# Altium schematic sheet SENSORS.SchDoc
size A4
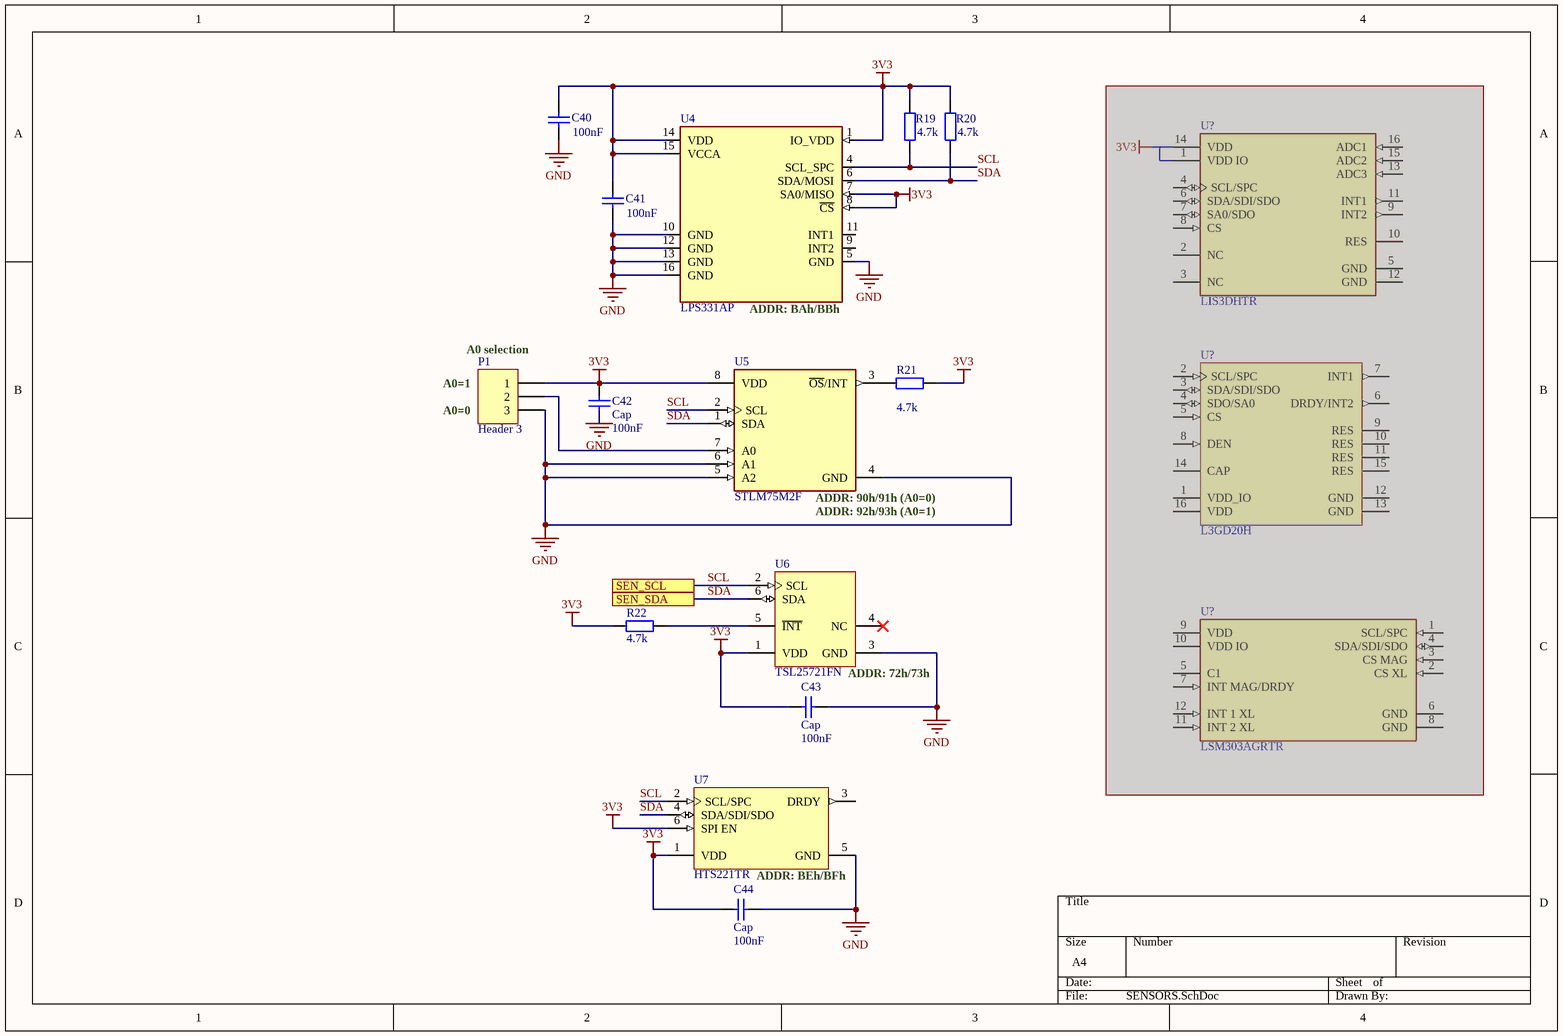
[diagram p0: SENSORS.SchDoc]

## Parts
(Parts that share a designator on the sheet are numbered #1, #2 ... from top to bottom, then left to right.)
C40  value 100nF  [0603_CAP_NPOL]  (hidden comment: Cap)
C41  value 100nF  [0603_CAP_NPOL]  (hidden comment: Cap)
C42  Cap  value 100nF  [0603_CAP_NPOL]
C43  Cap  value 100nF  [0603_CAP_NPOL]
C44  Cap  value 100nF  [0603_CAP_NPOL]
P1  Header 3  [GP_3x1_2mm]
R19  value 4.7k  [0402_RES]  (hidden comment: hy)
R20  value 4.7k  [0402_RES]  (hidden comment: hy)
R21  value 4.7k  [0402_RES]  (hidden comment: Res2)
R22  value 4.7k  [0402_RES]  (hidden comment: Res2)
U4  LPS331AP  [HCLGA-16/3MM]
U5  STLM75M2F  [FP-SO8-SO-A-MFG]
U6  TSL25721FN  [AMS-FN-6-2000X2000DE_V]
U7  HTS221TR  [STM-HTS221-HLGA-6]
U?#1  LIS3DHTR  [FP-LGA-16-7983231-MFG]  (masked out: inside a compile mask, not in the netlist)
U?#2  L3GD20H  [STM-LGA-16]  (masked out: inside a compile mask, not in the netlist)
U?#3  LSM303AGRTR  [FP-LGA-12-8487206-MFG]  (masked out: inside a compile mask, not in the netlist)

## Ports
SEN_SCL, SEN_SDA

## Nets
3V3: C40.2 C41.2 C42.2 C43.1 C44.1 P1.1 R19.2 R20.2 R21.2 R22.1 U4.1(IO_VDD) U4.7(SA0/MISO) U4.8(~{CS}) U4.14(VDD) U4.15(VCCA) U5.8(VDD) U6.1(VDD) U7.1(VDD) U7.6(SPI_EN)
GND: C40.1 C41.1 C42.1 C43.2 C44.2 P1.3 U4.5(GND) U4.10(GND) U4.12(GND) U4.13(GND) U4.16(GND) U5.4(GND) U5.5(A2) U5.6(A1) U6.3(GND) U7.5(GND)
SCL: R19.1 U4.4(SCL_SPC) U5.2(SCL) U6.2(SCL) U7.2(SCL/SPC) ; port SEN_SCL
SDA: R20.1 U4.6(SDA/MOSI) U5.1(SDA) U6.6(SDA) U7.4(SDA/SDI/SDO) ; port SEN_SDA
NetP1_2: P1.2 U5.7(A0)
NetR21_1: R21.1 U5.3(~{OS}/INT)
NetR22_2: R22.2 U6.5(~{INT})

Not connected (* = marked no-connect by the designer): U4 9(INT2) 11(INT1); U6 4(NC)*; U7 3(DRDY)

## Notes on the sheet
- (near U4) ADDR: BAh/BBh
- (near P1) A0=1
- (near P1) A0 selection
- (near P1) A0=0
- (near U5) ADDR: 90h/91h (A0=0)
- (near U5) ADDR: 92h/93h (A0=1)
- (near U6) ADDR: 72h/73h
- (near U7) ADDR: BEh/BFh

## Library data of the parts
C40-C44 = Cap: Capacitor; Published: 8-Jun-2000; LatestRevisionDate: 17-Jul-2002; LatestRevisionNote: Re-released for DXP Platform.; PackageReference: RAD-0.3; Publisher: Altium Limited; PackageDescription: Radial Cap, Thru-Hole; 2 Leads; 0.3 in Pin Spacing
P1 = Header 3: Header, 3-Pin; LatestRevisionDate: 17-Jul-2002; LatestRevisionNote: Re-released for DXP Platform.; Publisher: Altium Limited
R19 R20 R22 = Res2: Resistor; Published: 8-Jun-2000; LatestRevisionDate: 17-Jul-2002; LatestRevisionNote: Re-released for DXP Platform.; PackageReference: AXIAL-0.4; Publisher: Altium Limited; PackageDescription: Axial Device, Thru-Hole; 2 Leads; 0.4 in Pin Spacing
U4 = LPS331AP: IC PRESSURE SENSOR PIEZO 16HCLGA; Package: None; Price: None; Value: *; MP: LPS331AP; Availability: Unavailable
U5 = CMP-12184-000001-1: SENSOR DIGITAL -55C-125C 8SO; Manufacturer: STMicroelectronics; Max Supply Voltage: 5.5V; Standoff Height: 0.1mm; Operating Supply Current: 70-125uA; Resolution: 9bits; Interface: I2C,SMBus; Min Supply Voltage: 2.7V; Output Current: 10mA; Manufacturer Part Number: STLM75M2F; Device Class L1: Sensors; RoHS: TRUE; Package: SO8-SO-A; Height: 1.75mm; ComponentLink2URL: https://www.st.com/resource/en/datasheet/stlm75.pdf; Automotive: No; Mouser Description: STLM75 Series 5.5 V 10 mA Digital Temperature Sensor and Thermal Watchdog; Ambient Temperature Range Low: -55°C; Temperature Range High: +125°C; Octopart: https://octopart.com/stlm75m2f-stmicroelectronics-7122040; Digikey Description: SENSOR DIGITAL -55C-125C 8SO; Footprint Url: https://www.st.com/content/ccc/resource/technical/document/datasheet/group3/16/9a/68/4c/7d/03/4a/09/DM00396770/files/DM00396770.pdf/jcr:content/translations/en.DM00396770.pdf; Ipc Land Pattern Name: SOIC127P600X175-8; Category: IC; Temperature Range Low: -55°C; Device Class L3: unset; Ambient Temperature Range High: +125°C; Device Class L2: Temperature and Humidity Sensors; Lead Free: Yes; Temperature: -55°C to +125°C; ComponentLink2Description: Datasheet; Sensor Output: I2C,SMBus
U6 = CMP-0550-00028-2: Ambient Light Sensor, I2C Vbus = VDD Interface, 2.4 to 3.6 V, FN-6, Pb-Free, Reel; Manufacturer: AMS; Programmable: Gain, Integration Time, Interrupt; Interface: I2C - Vdd; Maximum Lux: 60000; Supply Voltage (V): 2.4 - 3.6; ComponentLink1Description: Manufacturer URL; ComponentLink2URL: http://www.ams.com/eng/content/download/291224/1065822/166800; PackageDescription: 6-Pin Dual Flat No-Lead, 2 x 2 mm Body, 0.65 mm Pitch; ComponentLink2Description: Datasheet; Mounting Technology: Surface Mount; PackageReference: FN-6; DatasheetVersion: TAOS132; ComponentLink1URL: www.ams.com; PackageVersion: TAOS059Q, 11/2009; PartNumber: TSL25721FN
U7 = CMP-2000-06428-1: Capacitive Digital Sensor for Relative Humidity and Temperature, 1.7 to 3.6 V, -40 to 120 degC, 6-Pin HLGA, RoHS, Tape and Reel; Manufacturer: STMicroelectronics; PartNumber: HTS221; Voltage - Supply: 1.7V~3.6V; Output Type: I²C,SPI; Voltage Supply Min: 1.7V; Accuracy: ±4.5%RH; Sensor Type: Humidity,Temperature; Voltage Supply Max: 3.6V; Response Time: 10s; Output: 16b; Humidity Range: 0~100%RH; Series: -; Category: Sensors,Transducers; Mounting Technology: SurfaceMount; Sensitivity: -; Datasheet URL: http://www2.st.com/content/ccc/resource/technical/document/datasheet/4d/9a/9c/ad/25/07/42/34/DM00116291.pdf/files/DM00116291.pdf/jcr:content/translations/en.DM00116291.pdf; Family: Humidity,MoistureSensors; Manufacturer URL: http://www.st.com/; Package Reference: HTS221-HLGA-6; Operating Temperature: -40°C~120°C; Mounting Type: SurfaceMount; Package Description: 6-Pin Top-Holed Cap Land Grid Array, Body 2 x 2 mm; Datasheet Version: Rev. 3, 10/2015
U?#1 = CMP-0234-00055-5: ACCEL 2-16G I2C/SPI 16LGA; Interface: I2C; Bandwidth: 5kHz; Operating Supply Voltage: 2.5V; Min Supply Voltage: 1.71V; Resolution: 16b; Max Supply Voltage (DC): 3.6V; Axis: X, Y, Z; Operating Supply Current: 11uA; Sensor Type: 3 Axis; Output Type: Digital; Lead Free: Lead Free; Case/Package: LGA; REACH SVHC: No SVHC; Width: 3mm; Height: 1mm; Packaging: Tape and Reel; Contact Plating: Gold; Length: 3mm; Package Quantity: 1; Min Supply Voltage (DC): 1.71V; Max Operating Temperature: 85°C; Min Operating Temperature: -40°C; Number of Pins: 16; Radiation Hardening: No; Depth: 3mm; Max Supply Voltage: 3.6V
U?#2 = CMP-1771-00002-2: MEMS Motion Sensor: Three-Axis Digital Output Gyroscope, 2.2 to 3.6 V, -40 to 85 degC, 16-Pin LGA, RoHS, Tray; ESR: 200 Ohm; Load Capacitance: 18 pF; Capacitance: 1.8E-11 f; Frequency: 8 MHz; Frequency Tolerance: 20ppm; DatasheetVersion: Rev. 2, 03/2013; ComponentLink1Description: Manufacturer URL; Length: 0.197 inch; Mount: Surface Mount; REACH SVHC: Unknown; ComponentLink2URL: http://www.st.com/content/ccc/resource/technical/document/datasheet/35/b1/e0/39/71/57/43/01/DM00060659.pdf/files/DM00060659.pdf/jcr:content/translations/en.DM00060659.pdf; Min Operating Temperature: -20degC; Height: 0.043 inch; Max Operating Temperature: 70degC; ComponentLink1URL: http://www.st.com/; Case/Package: CSMD; Packaging: Tape and Reel; Width: 0.126 inch; Resistance: 200 Ohm; ComponentLink2Description: Datasheet; Package Quantity: 1000; RoHSCompliant: True; Pins: 4; Tolerance: 20ppm; PackageReference: LGA-16; PackageDescription: 16-Pin Land Grid Array Package, Body 3 x 3 mm, Pitch 0.5 mm
U?#3 = CMP-2000-07465-2: IMU ACCEL/MAG I2C/SPI 12LGA; Manufacturer: STMicroelectronics; Accel Range: 2/4/8/16g; Operating Supply Current: 3.7-200uA; Sensor Output: I2C,SPI; Accel Resolution: 16bits; Max Supply Voltage: 3.6V; Min Supply Voltage: 1.71V; Mag Sense Range: 49.152gauss (g); Sensor Type: Temperature,Accelerometer,Magnetometer; Mouser Description: IMUs - Inertial Measurement Units Ultra-compact high-performance e-compass 3D accelerometer and 3D magnetometer module; Temperature Range High: +85°C; Package: LGA-12-8487206; Manufacturer Part Number: LSM303AGRTR; Category: IC; Device Class L3: Inertial Measurement Units (IMUs); Temperature: -40°C to +85°C; Device Class L2: Motion Sensors; ComponentLink2Description: Datasheet; Octopart: https://octopart.com/lsm303agrtr-stmicroelectronics-59386630; Automotive: No; Device Class L1: Sensors; Resolution: 16bits; RoHS: TRUE; Height: 1mm; ComponentLink2URL: https://www.st.com/resource/en/datasheet/lsm303agr.pdf; Lead Free: Yes; Temperature Range Low: -40°C; Footprint Url: https://www.st.com/content/ccc/resource/technical/document/technical_note/73/17/9c/16/dd/96/4a/01/CD00134799.pdf/files/CD00134799.pdf/jcr:content/translations/en.CD00134799.pdf; Digikey Description: IMU ACCEL/MAG I2C/SPI 12LGA
R21 = Res2: Published: 8-Jun-2000; LatestRevisionDate: 17-Jul-2002; LatestRevisionNote: Re-released for DXP Platform.; PackageReference: AXIAL-0.4; Publisher: Altium Limited; PackageDescription: Axial Device, Thru-Hole; 2 Leads; 0.4 in Pin Spacing